# EAGLE design 640 motherboard (EAGLE 6.3)
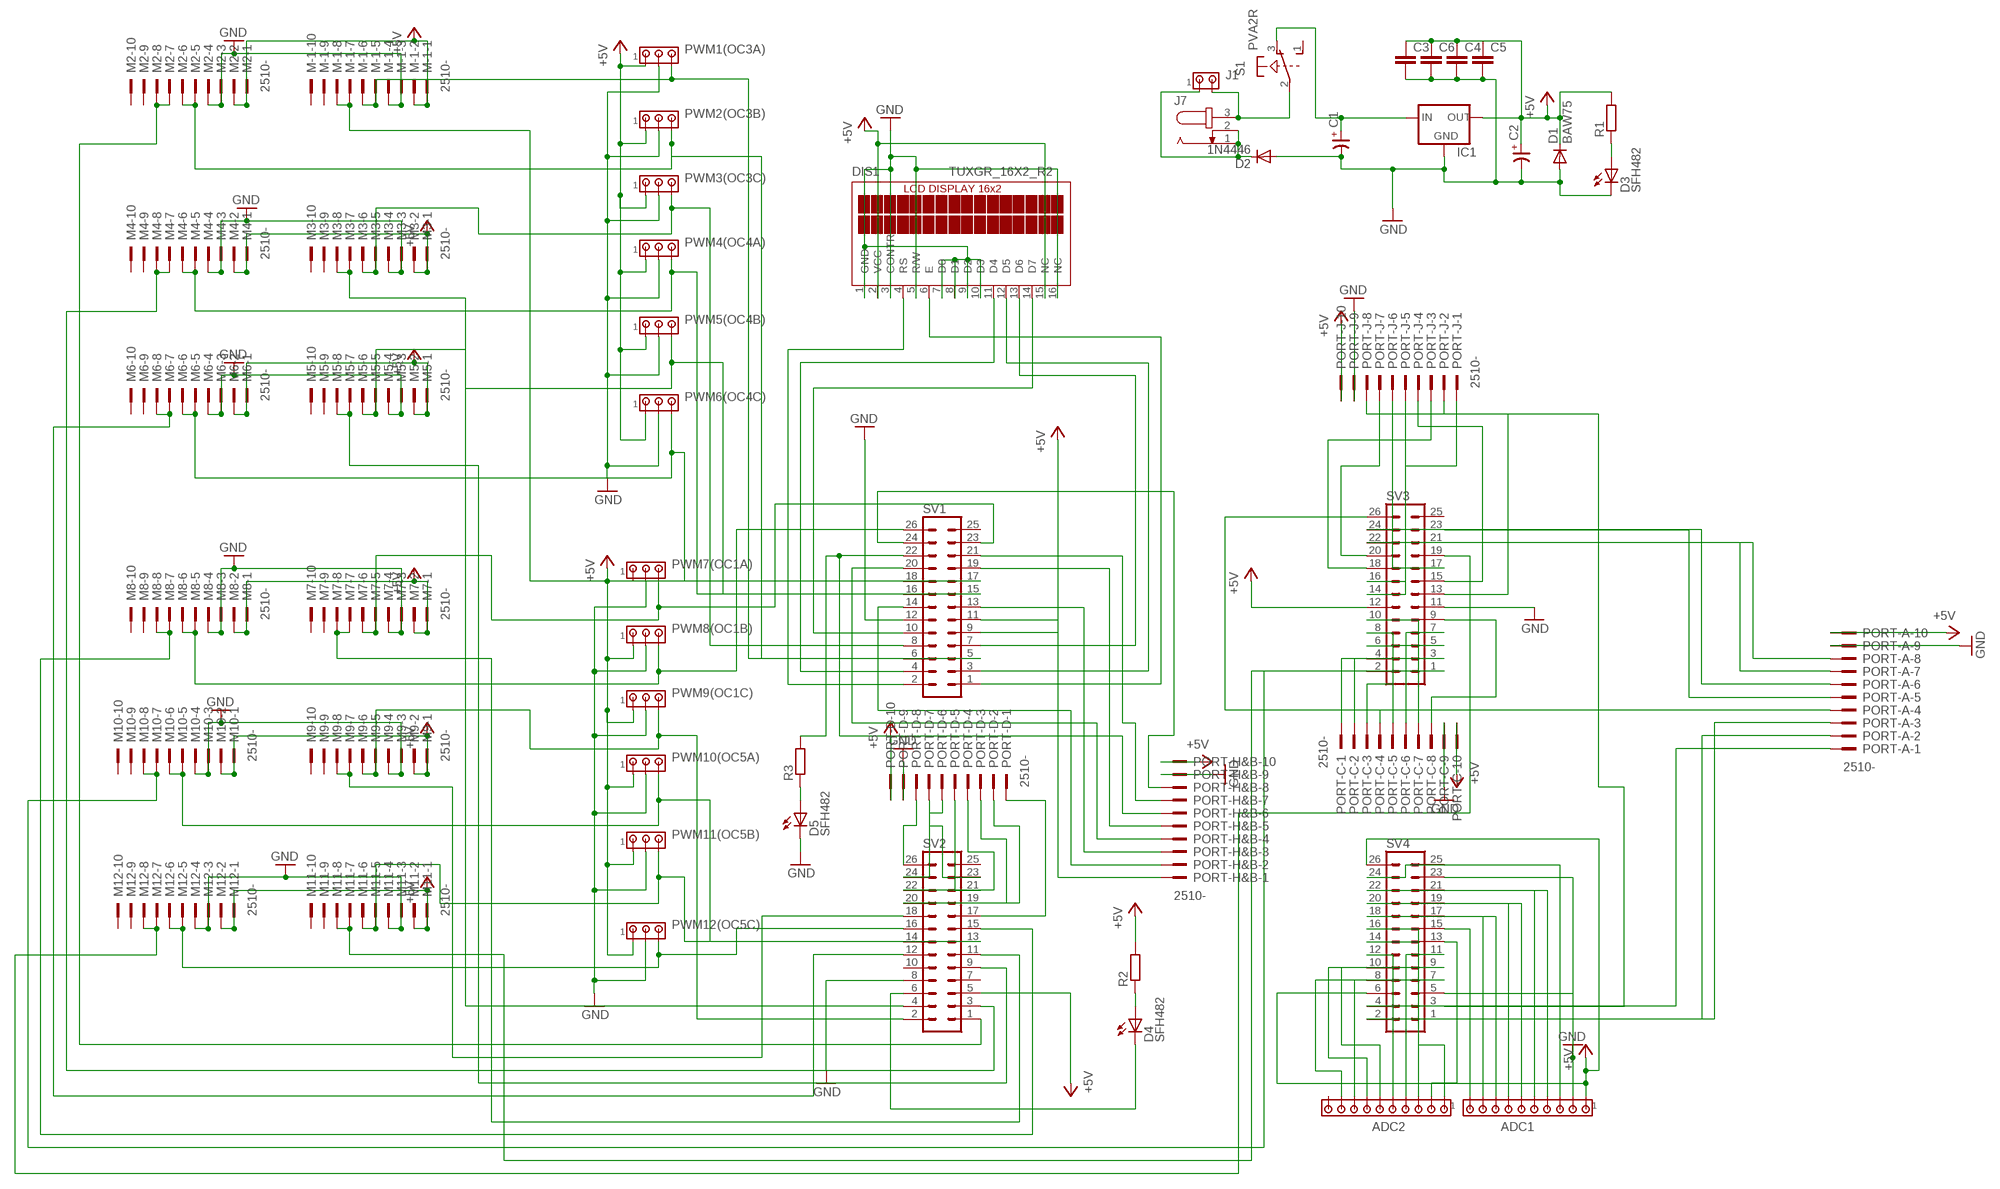
[diagram p0: schematic, sheet 1]

## Parts
ADC1  MTA10-100  [10X10MTA]
ADC2  MTA10-100  [10X10MTA]
C1  CP-E-050X125  [E-050X125]
C2  CP-E-050X125  [E-050X125]
C3  C2.5/2  [C2.5-2]
C4  C2.5/2  [C2.5-2]
C5  C2.5/2  [C2.5-2]
C6  C2.5/2  [C2.5-2]
D1  BAW75  [DO35-10]
D2  1N4446  [DO35-10]
D3  SFH482  [SFH482]
D4  SFH482  [SFH482]
D5  SFH482  [SFH482]
DIS1  TUXGR_16X2_R2  [TUXGR_16X2_R2]
IC1  LM323-TO3  [TO3-K02]
J1  MTA02-156  [1X2MTA]
J7  JACK-PLUG1  [SPC4078]
M2  2510-  [PAK100/2500-10]
M3  2510-  [PAK100/2500-10]
M4  2510-  [PAK100/2500-10]
M5  2510-  [PAK100/2500-10]
M6  2510-  [PAK100/2500-10]
M7  2510-  [PAK100/2500-10]
M8  2510-  [PAK100/2500-10]
M9  2510-  [PAK100/2500-10]
M10  2510-  [PAK100/2500-10]
M11  2510-  [PAK100/2500-10]
M12  2510-  [PAK100/2500-10]
M-1  2510-  [PAK100/2500-10]
PORT-A  2510-  [PAK100/2500-10]
PORT-C  2510-  [PAK100/2500-10]
PORT-D  2510-  [PAK100/2500-10]
PORT-H&B  2510-  [PAK100/2500-10]
PORT-J  2510-  [PAK100/2500-10]
PWM1(OC3A)  MTA03-100  [10X03MTA]
PWM2(OC3B)  MTA03-100  [10X03MTA]
PWM3(OC3C)  MTA03-100  [10X03MTA]
PWM4(OC4A)  MTA03-100  [10X03MTA]
PWM5(OC4B)  MTA03-100  [10X03MTA]
PWM6(OC4C)  MTA03-100  [10X03MTA]
PWM7(OC1A)  MTA03-100  [10X03MTA]
PWM8(OC1B)  MTA03-100  [10X03MTA]
PWM9(OC1C)  MTA03-100  [10X03MTA]
PWM10(OC5A)  MTA03-100  [10X03MTA]
PWM11(OC5B)  MTA03-100  [10X03MTA]
PWM12(OC5C)  MTA03-100  [10X03MTA]
R1  R-EU_0207/10  [0207/10]
R2  R-EU_0207/10  [0207/10]
R3  R-EU_0207/10  [0207/10]
S1  PVA2R  [PVA2R]
SV1  ML26  [ML26]
SV2  ML26  [ML26]
SV3  ML26  [ML26]
SV4  ML26  [ML26]

## Nets
+5V: ADC1.1 C2.+ C3.1 C4.1 C5.1 C6.1 D1.C DIS1.2(VCC) DIS1.15(NC) IC1.1(OUT) M2.1 M2.2 M3.1 M3.2 M4.1 M4.2 M5.1 M5.2 M6.1 M6.2 M7.1 M7.2 M8.1 M8.2 M9.1 M9.2 M10.1 M10.2 M11.1 M11.2 M12.1 M12.2 M-1.1 M-1.2 PORT-A.10 PORT-C.10 PORT-D.10 PORT-H&B.10 PORT-J.10 PWM1(OC3A).1 PWM2(OC3B).1 PWM3(OC3C).1 PWM4(OC4A).1 PWM5(OC4B).1 PWM6(OC4C).1 PWM7(OC1A).1 PWM8(OC1B).1 PWM9(OC1C).1 PWM10(OC5A).1 PWM11(OC5B).1 PWM12(OC5C).1 R1.2 R2.2 SV1.9 SV2.5 SV3.12 SV4.6 SV4.26
GND: ADC1.2 C1.- C2.- C3.2 C4.2 C5.2 C6.2 D1.A D2.A D3.K(C) D5.K(C) DIS1.1(GND) DIS1.3(CONTR) DIS1.5(R/W) DIS1.7(D0) DIS1.8(D1) DIS1.9(D2) DIS1.10(D3) DIS1.16(NC) IC1.3(GND) M2.3 M2.4 M3.3 M3.4 M4.3 M4.4 M5.3 M5.4 M6.3 M6.4 M7.3 M7.4 M8.3 M8.4 M9.3 M9.4 M10.3 M10.4 M11.3 M11.4 M12.3 M12.4 M-1.3 M-1.4 PORT-A.9 PORT-C.9 PORT-D.9 PORT-H&B.9 PORT-J.9 PWM1(OC3A).2 PWM2(OC3B).2 PWM3(OC3C).2 PWM4(OC4A).2 PWM5(OC4B).2 PWM6(OC4C).2 PWM7(OC1A).2 PWM8(OC1B).2 PWM9(OC1C).2 PWM10(OC5A).2 PWM11(OC5B).2 PWM12(OC5C).2 SV1.12 SV2.8 SV3.11 SV4.5 SV4.23
N$1: C1.+ IC1.2(IN) S1.3(1:O)
N$2: D2.C J1.1 J7.1 J7.2
N$3: PORT-C.1 SV3.4
N$4: M2.5 M2.6 PWM2(OC3B).3 SV1.5
N$5: M3.5 M3.6 PWM3(OC3C).3 SV1.8
N$6: M4.5 M4.6 PWM4(OC4A).3 SV1.16
N$7: M5.5 M5.6 PWM5(OC4B).3 SV1.15
N$8: M6.5 M6.6 PWM6(OC4C).3 SV1.18
N$9: M12.5 M12.6 PWM12(OC5C).3 SV2.16
N$10: PORT-C.2 SV3.3
N$11: M10.5 M10.6 PWM10(OC5A).3 SV2.14
N$12: M9.5 M9.6 PWM9(OC1C).3 SV2.2
N$13: M8.5 M8.6 PWM8(OC1B).3 SV1.26
N$14: M7.5 M7.6 PWM7(OC1A).3 SV1.23
N$15: ADC1.4 SV4.21
N$16: ADC1.5 SV4.22
N$17: ADC1.3 SV4.24
N$18: ADC1.6 SV4.19
N$19: ADC1.7 SV4.20
N$20: ADC1.8 SV4.17
N$21: ADC1.9 SV4.18
N$22: ADC1.10 SV4.15
N$23: ADC2.1 SV4.16
N$24: ADC2.2 SV4.13
N$25: ADC2.3 SV4.14
N$26: ADC2.4 SV4.11
N$27: ADC2.5 SV4.12
N$28: ADC2.7 SV4.10
N$29: ADC2.6 SV4.9
N$30: ADC2.9 SV4.8
N$31: M-1.5 M-1.6 PWM1(OC3A).3 SV1.6
N$32: M11.5 M11.6 PWM11(OC5B).3 SV2.13
N$33: PORT-C.3 SV3.6
N$34: PORT-C.4 SV3.5
N$35: PORT-C.5 SV3.8
N$36: PORT-C.6 SV3.7
N$37: PORT-C.7 SV3.10
N$38: PORT-C.8 SV3.9
N$39: PORT-J.1 SV3.14
N$40: PORT-J.2 SV3.13
N$41: PORT-J.3 SV3.16
N$42: PORT-J.4 SV3.15
N$43: PORT-J.5 SV3.18
N$44: PORT-J.6 SV3.17
N$45: PORT-J.7 SV3.20
N$46: PORT-J.8 SV4.3
N$47: ADC2.8 SV4.7
N$48: PORT-A.1 SV4.4
N$49: PORT-A.2 SV4.1
N$50: PORT-A.3 SV4.2
N$51: PORT-A.4 SV3.26
N$52: PORT-A.5 SV3.23
N$53: PORT-A.6 SV3.24
N$54: PORT-A.7 SV3.21
N$55: PORT-A.8 SV3.22
N$56: PORT-D.8 SV2.26
N$57: PORT-D.7 SV2.23
N$58: PORT-D.6 SV2.24
N$59: PORT-D.5 SV2.21
N$60: PORT-D.2 SV2.20
N$61: PORT-D.3 SV2.19
N$62: PORT-D.4 SV2.22
N$63: PORT-D.1 SV2.17
N$64: D3.A R1.1
N$65: J1.2 J7.3 S1.2(1:P)
N$66: DIS1.11(D4) SV1.4
N$67: DIS1.12(D5) SV1.3
N$68: DIS1.13(D6) SV1.7
N$69: DIS1.14(D7) SV1.10
N$70: DIS1.4(RS) SV1.2
N$71: DIS1.6(E) SV1.1
N$72: PORT-H&B.1 SV1.11
N$73: M2.7 M2.8 SV2.1
N$74: PORT-H&B.2 SV1.14
N$75: PORT-H&B.3 SV1.13
N$76: PORT-H&B.4 SV1.20
N$77: M3.7 M3.8 SV2.4
N$78: PORT-H&B.5 SV1.19
N$79: M-1.7 M-1.8 SV1.17
N$80: M5.7 M5.8 SV2.9
N$81: M4.7 M4.8 SV2.3
N$82: PORT-H&B.6 R3.2 SV1.22
N$83: PORT-H&B.7 SV1.21
N$84: M7.7 M7.8 SV2.11
N$85: M6.7 M6.8 SV2.12
N$86: PORT-H&B.8 SV1.24
N$87: D4.A R2.1
N$88: M9.7 M9.8 SV2.18
N$89: M8.7 M8.8 SV2.15
N$90: M11.7 M11.8 SV3.1
N$91: D4.K(C) SV2.6
N$92: M10.7 M10.8 SV3.2
N$97: M12.7 M12.8 SV3.19
N$104: D5.A R3.1
Unconnected: ADC2.10 M2.9 M2.10 M3.9 M3.10 M4.9 M4.10 M5.9 M5.10 M6.9 M6.10 M7.9 M7.10 M8.9 M8.10 M9.9 M9.10 M10.9 M10.10 M11.9 M11.10 M12.9 M12.10 M-1.9 M-1.10 S1.1(1:S) S1.4(2:S) S1.5(2:P) S1.6(2:O) SV1.25 SV2.7 SV2.10 SV2.25 SV3.25 SV4.25

## Library data of the parts
ADC1 ADC2 = con-amp:MTA10-100: AMP connector
C1 C2 = cap-master:CP-: POLARIZED CAP
C3-C6 = capacitor-wima:C: CAPACITOR naming: grid - package width
D1 = diode:BAW75: DIODE silicon-epitaxial planar diode
D2 = diode:1N4446: DIODE high speed (Philips)
D3-D5 = led:SFH482: IR LED infrared emitting diode, Infineon
DIS1 = display-lcd:TUXGR_16X2_R2: Tuxgraphics LCD display 16x2 characters reflective, without background light Source: tuxgr_12x2_r2.pdf
IC1 = v-reg:LM323-TO3: VOLTAGE REGULATOR
J1 = con-amp:MTA02-156: AMP connector
J7 = con-jack:JACK-PLUG: DC POWER JACK Power Jack, DC, Right Angle, Through Hole, Rated 5A at 16VDC, PC Terminals Distributor: Farnell (www.Farnell.de) Drawing: 84N1161.pdf / 84N1162.pdf Manufacturer: SPC Technology (www.spctechnology.com) Type: SPC4077 / SPC 4078
M2-M12 M-1 PORT-A PORT-C PORT-D PORT-H&B PORT-J = con-3m:2510-: 3M (TM) Pak 100 4-Wall Header Source: 3M
PWM1(OC3A) PWM2(OC3B) PWM3(OC3C) PWM4(OC4A) PWM5(OC4B) PWM6(OC4C) PWM7(OC1A) PWM8(OC1B) PWM9(OC1C) PWM10(OC5A) PWM11(OC5B) PWM12(OC5C) = con-amp:MTA03-100: AMP connector
R1-R3 = resistor:R-EU_: RESISTOR, European symbol
S1 = switch-misc:PVA2R: ITT SWITCH
SV1-SV4 = con-harting-ml:ML26: HARTING

## Board
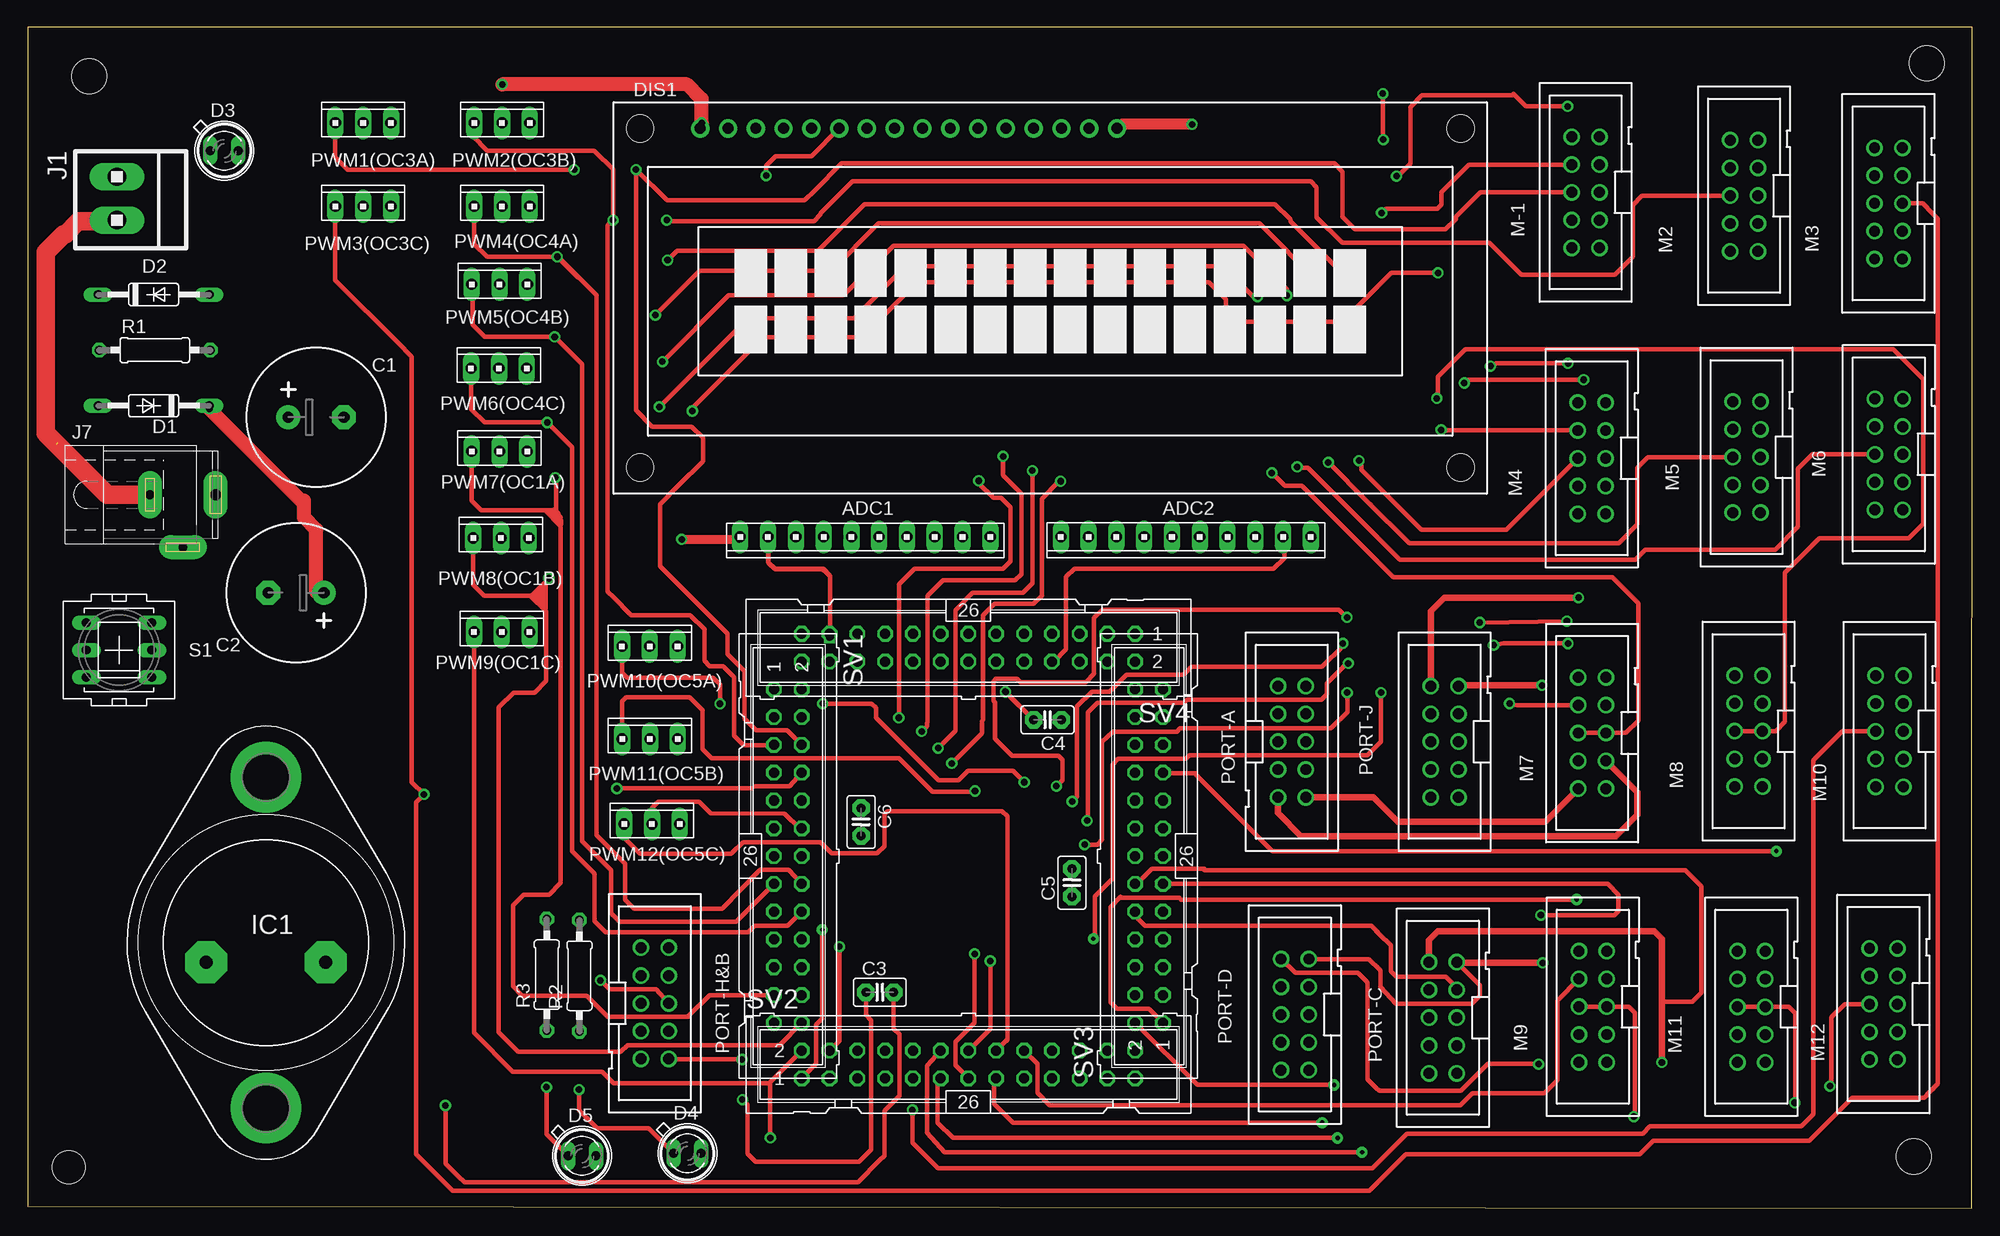
[diagram p1: board, top side]
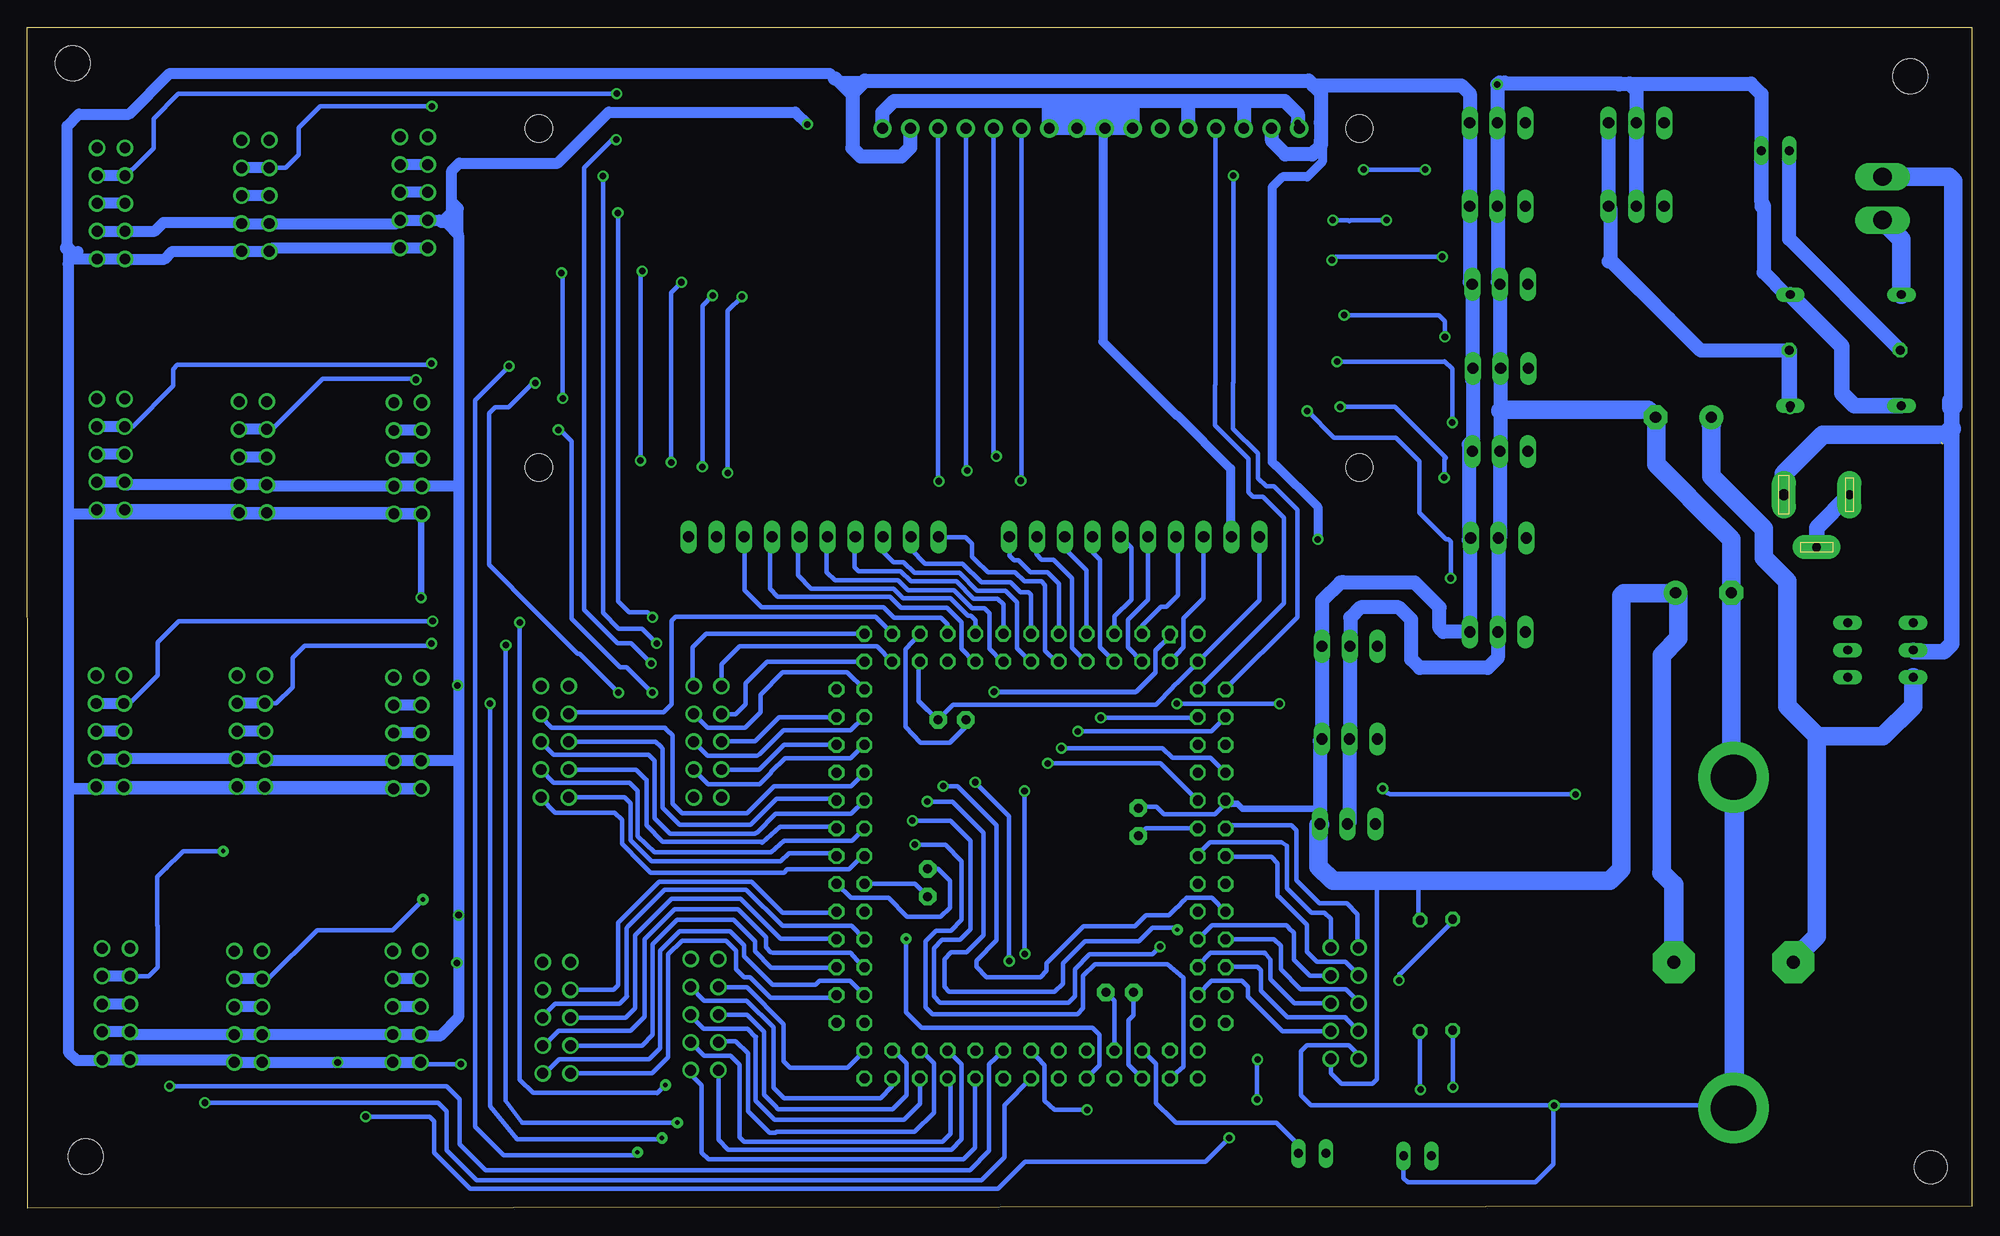
[diagram p2: board, bottom side, seen from below]

Size 177.78 x 107.93 mm. Coordinates in mm from the lower left corner, seen from the top.
Outline: 0,0.19 177.76,0 177.78,107.93 0.03,107.92 0,0.19
Copper layers (1*16): Top 0.035mm / dielectric 1.5mm / Bottom 0.035mm
Design rules "default": minimum track width 10mil, minimum drill 24mil, track to track 8mil, track to pad 8mil, pad to pad 8mil, via to via 8mil, smd to smd 8mil, copper to edge 40mil, drill to drill 8mil, minimum pad ring 10mil, minimum via ring 8mil, stop-mask expansion 4mil, vias tented up to drill 0mil, thermal gap 10mil
Holes 3.2 mm at 5.63,103.46 172.46,4.72 173.62,104.63
Holes 3 mm at 3.76,3.73

### Footprints (pad centres in the part's own frame; a part is rotated, then mirrored left to right if it is on the bottom)
10X10MTA = drill 1.016 long: 1 11.43,0; 2 8.89,0; 3 6.35,0; 4 3.81,0; 5 1.27,0; 6 -1.27,0; 7 -3.81,0; 8 -6.35,0; 9 -8.89,0; 10 -11.43,0
E-050X125 = drill 1.016 pad 2.184: + -2.54,0 | drill 1.016 pad 2.184 octagon: - 2.54,0
C2.5-2 = drill 0.813 pad 1.6 octagon: 1 -1.27,0; 2 1.27,0
DO35-10 = drill 0.813 long: A 5.08,0; C -5.08,0
SFH482 = drill 0.813 long: A -1.27,0; K 1.27,0
TUXGR_16X2_R2 = drill 1 pad 1.676: 1 -32,15.5; 2 -29.46,15.5; 3 -26.92,15.5; 4 -24.38,15.5; 5 -21.84,15.5; 6 -19.3,15.5; 7 -16.76,15.5; 8 -14.22,15.5; 9 -11.68,15.5; 10 -9.14,15.5; 11 -6.6,15.5; 12 -4.06,15.5; 13 -1.52,15.5; 14 1.02,15.5; 15 3.56,15.5; 16 6.1,15.5 | hole 2.5: -37.5,-15.5; 37.5,-15.5; -37.5,15.5; 37.5,15.5
TO3-K02 = drill 1.194 pad 3.81 octagon: 1 -1.778,-5.461; 2 -1.778,5.461 | drill 4.115 pad 6.477: 3 15.113,0; 3@ -15.113,0
1X2MTA = drill 1.676 long: 1 1.981,0; 2 -1.981,0
SPC4078 = drill 0.8 pad 2.184 long: 1 -3,0; 2 0,-4.8 | drill 1 pad 2.184 long: 3 3,0
PAK100/2500-10 = drill 1 pad 1.422: 1 -5.08,-1.27; 2 -5.08,1.27; 3 -2.54,-1.27; 4 -2.54,1.27; 5 0,-1.27; 6 0,1.27; 7 2.54,-1.27; 8 2.54,1.27; 9 5.08,-1.27; 10 5.08,1.27
10X03MTA = drill 1.016 long: 1 2.54,0; 2 0,0; 3 -2.54,0
0207/10 = drill 0.813 octagon: 1 -5.08,0; 2 5.08,0
PVA2R = drill 0.813 long: 1 -2.997,2.489; 2 -2.997,0; 3 -2.997,-2.489; 4 2.997,2.489; 5 2.997,0; 6 2.997,-2.489
ML26 = drill 0.914 octagon: 1 -15.24,-1.27; 2 -15.24,1.27; 3 -12.7,-1.27; 4 -12.7,1.27; 5 -10.16,-1.27; 6 -10.16,1.27; 7 -7.62,-1.27; 8 -7.62,1.27; 9 -5.08,-1.27; 10 -5.08,1.27; 11 -2.54,-1.27; 12 -2.54,1.27; 13 0,-1.27; 14 0,1.27; 15 2.54,-1.27; 16 2.54,1.27; 17 5.08,-1.27; 18 5.08,1.27; 19 7.62,-1.27; 20 7.62,1.27; 21 10.16,-1.27; 22 10.16,1.27; 23 12.7,-1.27; 24 12.7,1.27; 25 15.24,-1.27; 26 15.24,1.27

### Placement (x,y rotation side)
ADC1  76.58,61.35 180 top
ADC2  105.89,61.36 180 top
C1  26.38,72.3 0 top
C2  24.55,56.25 180 top
C3  77.91,19.73 0 top
C4  93.25,44.63 180 top
C5  95.48,29.75 90 top
C6  76.21,35.3 270 top
D1  11.52,73.35 180 top
D2  11.52,83.51 0 top
D3  17.98,96.65 0 top
D4  60.32,5.01 0 top
D5  50.68,4.79 0 top
DIS1  93.5,83.19 0 top
IC1  21.79,24.26 90 top
J1  8.17,92.29 270 top
J7  14.2,65.21 0 top
M2  156.93,92.54 90 top
M3  170.12,91.84 90 top
M4  143,68.54 90 top
M5  157.15,68.65 90 top
M6  170.16,68.9 90 top
M7  143.04,43.43 90 top
M8  157.34,43.6 90 top
M9  143.1,18.41 90 top
M10  170.23,43.59 90 top
M11  157.59,18.41 90 top
M12  169.67,18.66 90 top
M-1  142.44,92.84 90 top
PORT-A  115.58,42.63 270 top
PORT-C  129.4,17.41 90 top
PORT-D  115.86,17.69 90 top
PORT-H&B  57.34,18.72 270 top
PORT-J  129.55,42.63 90 top
PWM1(OC3A)  30.68,99.19 0 top
PWM2(OC3B)  43.38,99.19 0 top
PWM3(OC3C)  30.68,91.57 0 top
PWM4(OC4A)  43.38,91.57 0 top
PWM5(OC4B)  43.15,84.44 0 top
PWM6(OC4C)  43.09,76.76 0 top
PWM7(OC1A)  43.14,69.17 0 top
PWM8(OC1B)  43.28,61.25 0 top
PWM9(OC1C)  43.35,52.66 0 top
PWM10(OC5A)  56.88,51.36 0 top
PWM11(OC5B)  56.9,42.88 0 top
PWM12(OC5C)  57.08,35.11 0 top
R1  11.63,78.43 0 top
R2  50.45,21.24 90 top
R3  47.47,21.34 90 top
S1  8.36,51.01 0 top
SV1  69.51,32.18 270 top
SV2  86.02,13.13 0 top
SV3  102.53,32.18 90 top
SV4  86.02,51.23 180 top

### Tracks (layer width: path | path; a pad name or v marks a point on that pad's centre or on a via)
+5V  (via drill 0.6 pad 1.02)
  Top 0.406: C3.1 76.64,17.66 77.06,17.24 77.06,17.22 77.13,17.15 77.13,5.36 76.02,4.26 66.56,4.26 65.83,4.98 65.83,9.44 v65.35,9.92 | v65.31,13.59 58.66,13.59 PORT-H&B.10 | SV3.12 101.42,29.64 102.81,31.03 107.44,31.03 | 107.44,31.03 107.58,31.03 | 149.41,19.1 149.63,18.88 152.2,18.88 153.01,19.69 153.01,29.43 151.55,30.89 107.58,30.89 107.44,31.03 | PORT-D.10 114.62,22.77 115.9,21.5 121.65,21.5 122.48,20.66 122.48,11.8 123.32,10.97 | 123.32,10.97 | 123.32,10.97 123.57,10.72 131.03,10.72 132.24,11.93 133.51,13.2 138.11,13.2 v138.14,13.17
  Top 0.61: PORT-J.10 128.28,54.54 129.54,55.8 v141.79,55.8 | PORT-C.10 128.13,24.51 128.95,25.33 148.71,25.33 149.41,24.63 149.41,19.1 v149.41,13.33 | PORT-A.10 123.06,37.55 125.27,35.34 138.75,35.34 M7.2
  Top 0.813: v65.06,61.12 59.82,61.12 v59.81,61.13
  Top 1.27: C2.+ 26.39,56.32 26.39,62.02 25.28,63.13 25.28,64.67 25.01,64.67 v16.63,73.06 16.6,73.08 D1.C
  Bottom 0.406: PORT-H&B.10 58.62,12.33 57.66,11.38 54.83,11.38 54.41,11.79 54.41,29.15 54.34,29.22 54.34,29.71 54.55,29.92 | 51.66,29.92 51.47,29.73 | 48.61,29.92 48.97,29.56 | 94.55,44.63 C4.1 93.13,46.02 74.61,46.02 73.03,47.6 73.03,47.65 72.42,48.26 70.78,49.9 SV4.26 65.15,55.59 | 94.55,44.63 96.28,46.37 96.28,49.86 SV4.6 | SV1.9 68.24,36.97 69.22,35.98 73.86,35.98 74.55,36.68 76.1,36.68 C6.1 | C3.1 76.64,17.65 77.11,17.18 77.11,13.12 SV2.5 | SV3.12 96.64,29.64 C5.1 | 65.15,55.59 ADC1.1 | PWM1(OC3A).1 33.22,86.54 32.9,86.22 32.72,86.22 30.48,83.98 | v16.63,73.06 16.25,73.43 | 94.55,44.63 94.59,44.63 96.3,46.34 | v65.35,9.92 65.35,13.55 v65.31,13.59 | 142.22,63.46 141.79,63.03 | v138.14,13.17 141.67,13.17 M9.2 | 65.15,55.59 65.15,61.03 v65.06,61.12 | R2.2 50.59,26.32 50.59,29.92
  Bottom 0.61: 68.24,36.97 67.14,36.97 66.68,36.5 59.88,36.5 59.62,36.24 | 141.79,63.03 v141.79,55.8
  Bottom 0.813: 63.99,73.51 63.99,93.3 63.03,94.27 60.77,94.27 59.38,95.66 59.38,97.41 59.52,97.55 | 63.99,73.51 63.99,72.99 | v59.81,61.13 59.81,64.1 63.61,67.9 63.67,67.9 63.99,68.22 63.99,73.51
  Bottom 1: 102.36,101.91 102.61,101.91 103.76,103.05
  Bottom 1.016: M-1.2 M-1.1 155.36,87.76 M2.2 M2.1 164.52,87.46 165.23,86.75 M3.2 M3.1 173.73,86.76 173.8,86.82 | M6.1 M6.2 158.68,63.82 M5.1 M5.2 144.37,63.57 M4.1 142.22,63.46 | M10.1 M10.2 158.62,38.51 M8.1 M8.2 144.47,38.52 M7.1 M7.2 | M9.2 M9.1 v149.41,13.33 M11.2 M11.1 159.11,13.58 M12.2 M12.1 171.02,13.5 173.25,13.5 174.03,14.27 174.03,38.69 | 173.8,86.82 173.51,87.11 173.16,87.46 | 173.8,86.82 174.03,86.59 174.03,63.51 | 174.03,63.51 174.03,38.69 | M7.2 173.69,38.35 174.03,38.69 | 142.22,63.46 173.98,63.46 174.03,63.51 | 142.22,63.46 M4.2 | M7.2 173.79,38.35 173.97,38.53 | 103.93,103.23 103.76,103.05 | 103.94,103.23 104.43,103.71 164.75,103.71 168.47,100 173.07,100 174.16,98.91 174.16,87.76
  Bottom 1.27: PWM1(OC3A).1 PWM3(OC3C).1 33.06,91.41 33.06,86.6 30.42,83.95 | 46.01,69.78 46.01,61.05 45.83,61.24 PWM8(OC1B).1 45.89,61.19 PWM9(OC1C).1 48.32,52.66 48.67,53.02 48.67,54.92 50.94,57.18 57.48,57.18 | 46.01,69.78 45.81,69.98 45.81,69.3 PWM7(OC1A).1 | 45.63,75.64 45.63,70.16 46.01,69.78 | 45.63,75.64 PWM6(OC4C).1 | 45.63,75.64 45.69,75.7 PWM5(OC4B).1 45.92,84.67 PWM4(OC4A).1 PWM2(OC3B).1 45.92,101.86 46.69,102.63 60.2,102.63 60.38,102.8 | 59.42,50.8 59.42,42.9 PWM11(OC5B).1 59.62,42.7 59.62,36.24 PWM12(OC5C).1 | 59.42,50.8 PWM10(OC5A).1 | 57.48,57.18 57.76,57.18 59.41,55.52 59.41,50.81 59.42,50.8 | DIS1.15 97.06,96.95 97.88,96.13 101.59,96.13 102.36,96.89 102.36,101.91 101.21,103.05 60.63,103.05 60.38,102.8 | 60.38,102.8 59.52,101.94 59.52,99.23 | 59.52,99.23 59.52,97.55 59.52,97.12 60.32,96.32 62.77,96.32 63.99,97.54 63.99,98.65 DIS1.2 | 59.52,99.23 59.49,99.19 | 57.48,57.18 57.52,57.22 | 103.94,103.23 103.93,103.23 | 173.51,87.11 174.16,87.76 | 28.99,82.61 32.92,86.54 33.22,86.54 32.92,86.54 27.69,81.31 24.77,78.38 16.76,78.38 R1.2
  Bottom 1.422: R1.2 16.71,73.46 D1.C
  Bottom 1.676: PWM12(OC5C).1 59.74,35 59.74,31.22 58.44,29.92 54.55,29.92 51.66,29.92 50.59,29.92 48.61,29.92 33.11,29.92 32.04,30.99 32.04,55.97 31.81,56.2 27.15,56.2 C2.+ 26.82,55.98 26.82,52.08 28.36,50.54 28.36,30.67
  Bottom 1.778: IC1.1 27.25,29.56 28.36,30.67
GND  (via drill 0.6, 0.6 pad 1.02)
  Top 0.406: v73.32,52.15 SV4.23 73.38,52.57 73.38,57.81 72.77,58.42 68.32,58.42 67.72,59.02 67.72,61.33 ADC1.2 | C4.2 89.71,46.9 89.7,46.9 v89.39,47.21 | SV1.12 70.57,34.72 69.18,36.05 62.45,36.09 61.41,37.15 57.66,37.15 57.09,36.58 PWM12(OC5C).2 | C3.2 79.18,16.41 79.72,15.88 79.72,10.29 78.34,8.91 78.34,4.8 77.9,4.36 | 77.9,4.36 | 130.9,47.79 PORT-J.9 | 130.73,22.43 PORT-C.9 132.77,20.38 132.77,19.43 132.05,18.7 125.11,18.7 123.69,20.22 123.69,21.73 122.65,22.77 PORT-D.9 | v138.35,26.78 145.06,26.78 145.44,27.16 145.44,28.66 144.46,29.64 SV3.11 | v92.05,44.58 92.01,44.58 v89.41,47.18 | v73.41,52.19 73.41,52.22 73.38,52.25 73.38,57.74 72.8,58.32 72.74,58.32 72.68,58.38 68.32,58.38 67.74,58.96 67.74,61.36 v67.77,61.39 | v38.2,9.38 38.2,4.08 39.63,2.65 39.67,2.65 39.94,2.38 75.92,2.38 77.9,4.36
  Top 0.61: v138.46,47.79 130.9,47.79 | v138.51,22.43 130.73,22.43 | PORT-A.9 114.31,36.14 116.43,33.99 134.64,33.99 134.69,33.97 145.2,33.97 147.17,35.94 147.17,38.03 M7.3
  Top 1.016: v106.46,99.06 99.97,99.06 DIS1.16
  Top 1.27: v61.62,99.19 61.62,101.36 60.27,102.71 v43.4,102.71
  Bottom 0.406: PORT-H&B.9 56.08,14.04 56.94,14.91 60.78,14.91 61.33,14.36 61.33,10.31 60.44,9.42 40.04,9.42 | 40.04,9.42 22.17,9.42 22.1,9.49 22.1,39.06 IC1.3 | C4.2 91.98,44.04 93.47,42.54 96.12,42.54 | 96.12,42.54 97.5,44 97.5,51.1 SV4.5 | SV1.12 75.52,34.72 C6.2 | SV2.8 78.4,18.95 C3.2 | C5.2 94.53,31.02 93.43,29.92 93.43,27.47 94.29,26.62 97.34,26.62 99.05,28.37 102.49,28.37 SV3.11 | v73.32,52.15 73.47,52.15 74.64,50.98 74.64,48.95 76.38,47.21 v89.39,47.21 | 40.04,9.42 38.24,9.42 v38.2,9.38 38.26,9.32 38.26,4.02 39.9,2.38 51.59,2.38 51.95,2.75 D5.K | 138.38,40.89 138.38,47.72 v138.46,47.79 | 138.35,17.44 138.35,22.27 v138.51,22.43 | 96.12,42.54 93.42,42.54 91.92,44.04 91.92,44.45 v92.05,44.58 | v89.41,47.18 76.46,47.18 74.64,48.99 74.64,50.98 74.62,50.98 v73.41,52.19
  Bottom 0.813: v67.77,61.39 67.77,67.61 72.63,72.47 72.71,72.47 79.45,79.21 79.45,98.51 DIS1.8
  Bottom 1.016: M3.3 M3.4 166.13,89.29 165.32,90.1 158.3,90.1 M2.3 M2.4 144.02,90 M-1.3 M-1.4 140.12,90.3 139.91,90.1 | M6.3 M6.4 168.63,66.11 M5.3 M5.4 155.78,66 M4.3 M4.4 139.29,66 139.28,65.99 138.35,65.99 | M10.3 M10.4 168.94,41.06 M8.3 M8.4 155.9,40.89 M7.3 M7.4 138.38,40.89 138.35,40.86 | M12.3 M12.4 168.15,15.87 M11.3 M11.4 M9.3 M9.4 141.69,15.73 140.06,15.73 138.35,17.44 v138.35,26.78 138.35,40.86 | 139.91,90.1 139.51,90.1 138.35,88.94 138.35,65.99 | 138.35,65.99 138.35,40.86 | v106.46,99.06 107.58,100.18 124.62,100.18 129.29,95.51 138.3,95.51 138.98,94.83 138.98,91.03 139.91,90.1
  Bottom 1.27: PWM1(OC3A).2 PWM3(OC3C).2 30.68,102.15 31.3,102.78 32.18,102.78 | 43.35,90.94 43.38,90.98 PWM4(OC4A).2 43.35,91.54 43.35,90.94 | 43.35,90.9 43.35,90.94 | 19.25,91.93 D3.K | 19.25,91.93 19.25,101.82 19.76,102.34 20.2,102.78 32.18,102.78 | 19.25,91.93 19.25,91.57 | 43.38,102.7 PWM2(OC3B).2 43.38,90.94 43.35,90.9 | 43.38,102.7 43.18,102.89 43.1,102.81 42.63,102.81 | 32.18,102.78 32.24,102.71 32.24,102.74 32.32,102.81 42.63,102.81 | v43.4,102.71 43.38,102.7 | 42.63,102.81 42.7,102.89 | 43.35,90.9 43.35,84.64 PWM5(OC4B).2 43.15,76.82 PWM6(OC4C).2 43.09,72.9 43.09,69.23 PWM7(OC1A).2 43.14,61.4 PWM8(OC1B).2 43.29,52.73 PWM9(OC1C).2 43.35,50.31 44.28,49.38 50.49,49.38 51.26,50.15 51.26,53.79 52.39,54.92 55.9,54.92 56.83,53.99 56.83,51.41 PWM10(OC5A).2 56.88,42.9 PWM11(OC5B).2 56.9,35.62 56.91,35.61 56.91,35.29 PWM12(OC5C).2 | DIS1.8 DIS1.9 DIS1.10 | DIS1.7 DIS1.8 | DIS1.16 99.6,100.15 98.53,101.22 76.65,101.22 | 66.52,101.22 62.85,101.22 61.62,99.99 v61.62,99.19 | 71.72,101.22 66.52,101.22 | 76.65,101.22 71.72,101.22 | v61.62,99.19 61.62,98.81 DIS1.1 61.5,99.06 v61.62,99.19 | 66.52,101.22 66.58,101.16 DIS1.3 66.61,98.65 | DIS1.7 76.74,101.14 76.65,101.22 | DIS1.7 DIS1.8 | DIS1.8 84.31,98.69 84.38,98.62 84.38,100.61 77.34,100.61 77,100.26 77,99.69 77.08,99.61 83.42,99.61 83.58,99.46 | DIS1.5 71.66,101.15 71.72,101.22 | D2.A 17,83.51 19.03,85.54 19.03,91.71 19.25,91.93
  Bottom 1.422: D1.A 10.75,73.35 11.89,74.48 11.89,78.79 D2.A
  Bottom 1.676: 43.09,72.9 43.01,72.98 29.61,72.98 C1.- 28.84,72.22 28.84,67.97 26.98,66.11 24.68,63.81 22.01,61.14 C2.- 22.01,39.6 IC1.3
  Bottom 1.778: IC1.3 22.97,40.55
N$1
  Bottom 1.676: IC1.2 16.33,22.69 14.16,24.86 14.16,43.17 | 14.16,43.17 16.87,45.88 16.87,57.31 19.02,59.46 19.02,62.09 21.9,64.97 | 21.9,64.97 22.29,65.36 | 23.84,71.6 23.84,66.91 21.9,64.97 | S1.3 5.36,45.89 8.13,43.12 14.11,43.12 14.16,43.17
  Bottom 1.778: 23.84,71.6 C1.+
N$2  (1 unrouted)
  Top 1.676: 2.65,69.84 2.03,70.46 | 2.03,70.46 1.66,70.83 1.66,87.39 3.3,89.03 3.48,89.03 4.64,90.19 8.06,90.19 J1.1 | J7.1 7.28,65.21 2.03,70.46
  Bottom 1.422: J7.2 14.2,62.21 J7.1
  Bottom 1.676: D2.C 6.44,88.58 J1.1
N$3
  Bottom 0.406: PORT-C.1 130.44,12.33 129.15,13.61 120.92,13.61 119.92,14.6 119.92,23.52 118.13,25.32 113.55,25.32 112.24,24.02 112.24,23.03 109.64,20.43 105.74,20.43 105.37,20.8 102.57,20.8 SV3.4
N$4  (via drill 0.6 pad 1.02)
  Top 0.406: 68.11,42.47 SV1.5 68.21,42.31 66.88,42.31 65.46,42.31 64.6,43.16 64.6,48.54 64.42,48.72 64.39,48.72 63.57,49.54 62.36,49.54 61.88,50.02 61.88,52.9 60.57,54.2 55.19,54.2 53.52,55.87 53.52,55.88 53.04,56.36 53.04,89.84 v53.52,90.31 53.52,94.95 51.8,96.67 42.01,96.67 40.71,97.96 40.71,99.06 PWM2(OC3B).3 | M2.6 147.6,92.54 146.74,91.68 146.74,86.95 145.1,85.31 136.57,85.31 133.66,88.22 120.21,88.22 117.85,90.58 117.85,93.31 117.3,93.86 75.43,93.86 72.52,90.95 72.52,90.86 71.88,90.22 58.53,90.22 v58.44,90.31
  Bottom 0.406: v53.52,90.31 56.8,90.31 56.89,90.22 56.98,90.31 v58.44,90.31
  Bottom 1.016: M2.6 M2.5
N$5  (via drill 0.6 pad 1.02)
  Top 0.406: PWM3(OC3C).3 28.14,84.83 33.83,79.14 35.13,77.84 35.13,38.93 v36.24,37.82 35.53,37.11 35.53,4.93 38.87,1.58 122.66,1.58 126.02,4.95 147.42,4.95 148.64,6.17 162.91,6.17 166.81,10.08 173.38,10.08 173.88,10.57 | v53.87,38.36 66.2,38.36 66.51,38.57 69.65,38.57 SV1.8 | 173.88,10.57 174.27,10.97 | M3.5 173.25,91.84 174.18,90.91 174.65,90.43 174.65,11.35 173.88,10.57
  Bottom 0.406: v36.24,37.82 53.23,37.82 53.35,37.94 53.45,37.94 v53.87,38.36
  Bottom 1.016: M3.6 M3.5
N$6  (via drill 0.6 pad 1.02)
  Top 0.406: PWM4(OC4A).3 40.84,88.12 42,86.96 48.49,86.96 50.38,85.08 | 50.38,85.08 52.03,83.42 52.03,34.09 54.63,31.49 54.63,28.17 55.46,27.35 63.48,27.35 66.98,30.93 69.57,30.93 SV1.16 | v121.72,68.33 121.94,68.54 121.94,67.49 127.42,62 135.21,62 138.44,65.24 138.44,65.26 M4.6 | v121.56,85.64 120.01,85.64 115.44,90.21 115.44,90.37 114.03,91.78 76.52,91.78 72.27,87.53 59.4,87.53 v58.51,86.64 | 50.38,85.08 50.31,85.08 v48.42,86.96
  Bottom 0.406: v121.72,68.33 121.72,85.48 v121.56,85.64 | v48.42,86.96 58.2,86.96 v58.51,86.64
  Bottom 1.016: M4.6 M4.5
N$7  (via drill 0.6 pad 1.02)
  Top 0.406: PWM5(OC4B).3 40.61,85.52 40.68,85.59 40.68,80.73 41.78,79.64 v48.18,79.64 50.22,77.6 50.69,77.13 50.69,33.56 53.34,30.9 53.34,26.98 54.13,26.2 64.79,26.2 SV1.15 | M5.6 148.14,68.65 147.19,67.7 147.19,62.5 145.46,60.77 126.32,60.77 122.5,64.58 | v117.98,84.63 112.61,90 77.81,90 73.48,85.68 61.45,85.68 v57.39,81.62 | v118.92,68.17 122.5,64.58 | 122.5,64.58 122.86,64.23
  Bottom 0.406: v118.92,68.17 118.92,83.69 v117.98,84.63 | v48.18,79.64 48.18,81.05 48.75,81.62 v57.39,81.62
  Bottom 1.016: M5.6 M5.5
N$8  (via drill 0.6 pad 1.02)
  Top 0.406: PWM6(OC4C).3 40.55,73.03 41.77,71.81 v47.52,71.81 49.8,69.53 49.8,32.61 51.86,30.55 51.86,26.2 52.83,25.23 65.87,25.23 66.45,25.81 69.49,25.81 SV1.18 | M6.6 163.19,68.9 161.85,67.56 161.85,62.27 159.78,60.2 147.91,60.2 146.97,59.26 125.47,59.26 117.05,67.67 116.15,67.67 v116.07,67.75 | v115.13,83.42 115.13,84 111.17,87.95 79.15,87.95 74.62,83.42 64.08,83.42 v58.04,77.38
  Bottom 0.406: v116.07,67.75 116.07,82.48 v115.13,83.42 | v58.04,77.38 48.29,77.38 48.24,77.43 47.52,76.7 v47.52,71.81
  Bottom 1.016: M6.6 M6.5
N$9  (via drill 0.6 pad 1.02)
  Top 0.406: PWM12(OC5C).3 54.55,33.84 55.99,32.39 64.32,32.39 65.39,33.46 72.48,33.46 73.49,32.46 77.64,32.46 78.34,33.1 78.34,33.57 78.34,33.63 78.34,36.01 78.61,36.28 89.11,36.28 89.57,35.82 89.57,15.42 89.24,15.09 | 89.24,15.09 SV2.16 | 89.24,15.09 89.5,15.35 | M12.6 166.13,18.66 164.9,17.43 164.9,11.28 v164.77,11.15
  Bottom 0.406: v164.77,11.15 139.47,11.15 138.26,9.94 138.26,5.86 135.86,3.46 91.6,3.46 89.85,5.26 89.85,13.15 SV2.16
  Bottom 1.016: M12.6 M12.5
N$10
  Bottom 0.406: PORT-C.2 120.65,12.33 119.18,13.8 119.18,23.21 117.94,24.45 113.92,24.45 112.99,23.52 112.99,21.85 112.24,21.11 111.69,21.11 109.83,19.25 104.03,19.25 SV3.3
N$11  (via drill 0.6 pad 1.02)
  Top 0.406: PWM10(OC5A).3 54.34,48.95 54.8,48.49 62.68,48.49 63.3,47.87 63.3,46.29 63.28,46.26 63.28,46.12 v63.3,46.1 | v91.12,38.93 91.08,38.89 | v88.01,22.6 88.01,16.4 SV2.14 | v72.69,46.12 77.15,46.12 77.55,45.72 77.55,44.84 83.29,39.1 85.09,39.1 85.97,39.98 90.07,39.98 v91.12,38.93 | v91.12,38.93 90.95,39.1 | M10.6 165.91,43.59 163.25,40.93 163.25,8.59 162.14,7.47 148.31,7.47 147.66,6.82 126.12,6.82 122.96,3.66 83.22,3.66 80.89,5.99 v80.89,8.99
  Bottom 0.406: v63.3,46.1 72.67,46.1 v72.69,46.12 | v91.12,38.93 88.01,35.82 v88.01,22.6 | v80.89,8.99 83.87,8.99 84.8,9.82 84.8,13.08 SV2.14
  Bottom 1.016: M10.6 M10.5
N$12  (via drill 0.6 pad 1.02)
  Top 0.406: PWM9(OC1C).3 40.81,16.03 44.36,12.48 52.51,12.48 53.58,11.4 67.78,11.4 68.03,11.66 | 68.03,11.66 SV2.2 | M9.6 146.39,18.41 146.94,17.87 146.94,8.45 v146.85,8.37 | v67.9,6.42 67.9,11.52 68.03,11.66
  Bottom 0.406: v146.85,8.37 141.01,8.37 140.6,7.96 140.6,5.07 137.28,1.75 121.34,1.75 121.3,1.79 89.02,1.79 86.58,4.24 70.09,4.24 v67.9,6.42
  Bottom 1.016: M9.6 M9.5
N$13  (via drill 0.6 pad 1.02)
  Top 0.406: PWM8(OC1B).3 40.74,56.98 41.73,55.99 45.95,55.99 | 45.95,55.99 47.39,54.55 47.41,54.52 47.41,48.19 46.35,47.12 44.42,47.12 43.08,45.79 43.08,16.07 44.87,14.29 54.21,14.29 54.83,14.91 68.75,14.91 SV1.26 | M8.6 159.83,43.6 160.66,44.44 160.66,58.08 161.75,59.17 161.75,59.18 163.83,61.25 172,61.25 173.31,62.56 173.31,75.77 170.58,78.5 131.45,78.5 128.94,75.98 128.94,74.13 v128.83,74.02 | v128.94,85.48 124.7,85.48 120.22,81.01 110.63,81.01 109.54,82.1 109.54,83.08 108.01,84.61 81.31,84.61 76.29,79.59 67.26,79.59 60.77,73.1 v60.77,72.86 | 45.95,55.99 45.99,55.99 47.37,54.62 47.37,57.28 v47.66,57.58
  Bottom 0.406: v128.83,74.02 128.83,85.37 v128.94,85.48 | 47.86,61.13 47.69,60.97 | v47.66,57.58 47.66,60.93 47.86,61.13 | 47.86,61.13 48.08,61.13 50.53,63.58 50.53,68.29 51.62,69.38 | 51.62,69.38 | 51.62,69.38 52.65,70.41 58.32,70.41 v60.77,72.86
  Bottom 1.016: M8.6 M8.5
N$14  (via drill 0.6 pad 1.02)
  Top 0.406: PWM7(OC1A).3 40.6,64.66 41.47,63.79 47.3,63.79 | 47.3,63.79 48.75,62.34 48.75,32.22 48.74,32.21 48.74,29.73 47.68,28.67 45.36,28.67 44.38,27.69 44.38,20.27 45.22,19.44 51.09,19.44 53.02,17.51 60.42,17.51 60.45,17.53 60.45,17.58 62.35,19.48 SV1.23 | M7.6 146.12,43.43 147.24,44.55 147.24,55.29 144.88,57.65 124.88,57.65 118.62,63.91 | 118.62,63.91 116.5,66.03 114.93,66.03 v113.75,67.21 | 118.62,63.91 118.99,63.54 | v112.44,83.32 112.05,83.32 109.3,86.07 80.27,86.07 75.55,81.35 65.88,81.35 v57.76,73.23 | 47.3,63.79 47.34,63.79 47.8,63.33 47.85,63.33 48.34,63.82 48.34,66.69 v48.25,66.78
  Bottom 0.406: v113.75,67.21 113.75,82.01 v112.44,83.32 | v57.76,73.23 52.73,73.23 48.24,68.74 | 48.24,68.74 48.11,68.61 48.25,68.47 v48.25,66.78 | 48.24,68.74 48.27,68.72
  Bottom 1.016: M7.6 M7.5
N$15
  Bottom 0.406: SV4.21 75.86,53.24 74.13,54.96 73.65,54.96 72.58,56.03 72.58,61.16 ADC1.4
N$16
  Bottom 0.406: ADC1.5 75.31,55.62 77.15,53.78 77.15,51.26 SV4.22
N$17
  Bottom 0.406: ADC1.3 70.23,55.73 72.1,53.93 72.1,51.25 SV4.24
N$18
  Bottom 0.406: SV4.19 78.4,54.09 76.86,55.63 76.86,60.36 ADC1.6
N$19
  Bottom 0.406: ADC1.7 80.39,59.97 79.7,59.28 79.7,51.26 SV4.20
N$20
  Bottom 0.406: SV4.17 80.94,58.31 82.94,60.31 82.94,61.34 ADC1.8
N$21
  Bottom 0.406: SV4.18 81,49.96 82.28,51.24 82.28,57.58 83.98,59.28 85.05,59.28 85.52,59.76 85.52,61.3 ADC1.9
N$22
  Bottom 0.406: SV4.15 83.48,57.08 84.53,58.14 86.08,58.14 87.18,59.24 87.59,59.24 88,59.65 88,61.34 ADC1.10
N$23
  Bottom 0.406: SV4.16 83.71,49.96 84.74,50.94 84.74,56.92 85.06,57.29 86.63,57.29 87.47,58.12 89.97,58.12 91.08,59.23 | 91.08,59.23 | 91.08,59.23 91.4,59.56 91.4,60.72 92.01,61.32 94.43,61.32 ADC2.1
N$24
  Bottom 0.406: SV4.13 86.02,56.07 86.26,56.31 87,56.31 87.88,57.19 90.57,57.19 92.28,58.91 95.71,58.91 97.01,60.21 ADC2.2
N$25
  Bottom 0.406: SV4.14 86.07,49.96 87.28,51.17 87.28,55.39 88.35,56.45 90.94,56.45 92.56,58.07 96.68,58.07 97.66,59.05 98.58,59.05 99.51,59.97 99.51,61.32 ADC2.3
N$26
  Bottom 0.406: SV4.11 88.56,55.18 89.09,55.71 91.26,55.71 92.84,57.29 97.01,57.29 97.93,58.21 101.79,58.21 102.16,58.59 102.16,61.28 ADC2.4
N$27
  Bottom 0.406: SV4.12 88.67,49.96 89.83,51.12 89.83,54.37 90.29,54.83 91.4,54.83 93.07,56.5 97.29,56.5 98.17,57.38 103.95,57.38 104.71,58.14 104.71,61.27 ADC2.5
N$28
  Bottom 0.406: SV4.10 91.22,49.96 92.38,51.12 92.38,53.53 93.72,54.88 97.89,54.88 98.91,55.9 109.18,55.9 109.9,56.62 109.9,61.16 ADC2.7
N$29
  Bottom 0.406: SV4.9 91.1,53.74 91.5,54.13 91.77,54.13 93.4,55.76 97.7,55.76 98.58,56.64 106.12,56.64 107.31,57.83 107.31,61.21 ADC2.6
N$30
  Top 0.406: SV4.8 93.86,49.96 94.93,51.08 94.93,57.7 95.71,58.44 113.91,58.44 114.89,59.42 114.89,61.25 ADC2.9
N$31  (via drill 0.6 pad 1.02)
  Top 0.406: PWM1(OC3A).3 28.14,96.03 29.25,94.93 v49.97,94.93 | 60.83,55.64 63.98,52.49 63.98,50.62 65.55,49.06 65.55,44.74 66.55,43.74 66.55,43.71 66.58,43.68 69.44,43.68 SV1.6 | 60.83,55.64 60.43,56.05 | M-1.6 132.82,92.84 130.58,90.6 130.58,90.4 129.63,89.46 121.35,89.46 120.21,90.6 120.21,94.75 119.46,95.5 74.44,95.5 71.98,93.05 71.04,92.11 58.45,92.11 v55.62,94.93 55.62,72.92 57.1,71.44 60.71,71.44 61.74,70.41 61.74,68.28 59.48,66.03 57.81,64.35 57.81,58.66 60.83,55.64
  Bottom 0.406: v55.62,94.93 v49.97,94.93
  Bottom 1.016: M-1.6 M-1.5
N$32  (via drill 0.6 pad 1.02)
  Top 0.406: PWM11(OC5B).3 54.36,46.34 54.7,46.68 60.52,46.68 61.71,45.5 61.71,41.95 62.52,41.14 79.67,41.14 82.75,38.06 86.54,38.06 v86.61,38.13 | v86.58,23.24 86.58,16.95 84.82,15.19 84.82,13.06 SV2.13 | M11.6 161.02,18.41 161.6,17.82 161.6,9.68 v161.56,9.64
  Bottom 0.406: v86.61,38.13 86.61,23.28 v86.58,23.24 | v161.56,9.64 140.24,9.64 139.45,8.85 139.45,5.3 136.69,2.54 90.55,2.54 88.45,4.64 88.45,9.43 SV2.13
  Bottom 1.016: M11.6 M11.5
N$33
  Bottom 0.406: PORT-C.3 130.56,14.87 129.22,16.21 122.65,16.21 121.35,17.51 121.35,24.58 118.62,27.3 112.8,27.3 110.26,24.76 110.26,23.83 109.83,23.4 | 109.83,23.4 | 109.83,23.4 109.64,23.34 102.52,23.34 101.65,22.35 101.58,22.35 SV3.6
N$34
  Bottom 0.406: PORT-C.4 121.58,14.87 120.61,15.84 120.61,24.14 118.38,26.37 113.24,26.37 111.25,24.39 111.25,23.46 109.77,21.97 103.85,21.97 SV3.5
N$35
  Bottom 0.406: PORT-C.5 130.67,17.55 129.53,18.69 123.64,18.69 122.96,19.37 123.02,19.43 123.02,25.58 122.89,25.71 122.89,25.73 119.52,29.1 112.06,29.1 108.71,25.82 102.45,25.82 SV3.8
N$36
  Bottom 0.406: PORT-C.6 123.07,17.41 122.22,18.26 122.22,24.95 118.87,28.29 112.56,28.29 108.9,24.64 103.88,24.64 SV3.7
N$37
  Top 0.406: PORT-C.7 130.67,20.15 129.65,21.17 125.13,21.17 124.63,21.66 124.63,24.02 123.64,25.01 | 123.64,25.01 123.27,25.38 | SV3.10 101.26,26.71 102.15,25.82 122.84,25.82 123.64,25.01
N$38
  Bottom 0.406: PORT-C.8 124.18,19.95 123.76,20.36 123.76,26.1 120.03,29.83 111.55,29.83 108.71,26.99 103.91,26.99 SV3.9
N$39
  Bottom 0.406: PORT-J.1 130.82,37.46 129.53,36.16 124.07,36.16 123.39,35.48 123.39,33.31 121.61,31.5 | 121.61,31.5 120.98,30.85 | SV3.14 101.46,32.18 102.6,31.04 102.6,31.03 102.66,30.97 108.32,30.97 108.62,30.67 120.78,30.67 121.61,31.5
N$40
  Bottom 0.406: PORT-J.2 123.17,37.55 122.65,37.03 122.65,33.62 120.73,31.7 108.9,31.7 108.16,32.45 104.06,32.45 SV3.13
N$41
  Bottom 0.406: PORT-J.3 130.82,40.06 129.65,38.89 122.71,38.89 121.97,38.15 121.97,33.99 120.42,32.54 109.77,32.54 108.61,33.56 102.37,33.56 SV3.16
N$42
  Bottom 0.406: PORT-J.4 122.12,40.09 121.29,39.26 121.29,39.25 121.18,39.15 121.18,34.98 119.69,33.49 110.67,33.49 110.59,33.41 108.96,34.86 103.94,34.86 SV3.15
N$43
  Bottom 0.406: PORT-J.5 130.82,42.6 129.65,41.43 120.98,41.43 120.42,40.88 120.42,35.64 119.03,34.24 111.24,34.24 111.15,34.33 111.06,34.33 109.36,36.04 102.48,36.04 SV3.18
N$44
  Bottom 0.406: PORT-J.6 120.32,42.63 119.91,42.22 | 119.91,42.22 119.8,42.11 | SV3.17 103.94,37.4 109.29,37.4 111.65,35.05 118.13,35.05 119.7,36.61 119.7,42.01 119.91,42.22
N$45
  Bottom 0.406: PORT-J.7 130.82,44.9 129.83,43.91 119.49,43.91 119.42,43.83 | 119.42,43.83 119.06,43.48 | SV3.20 102.48,38.58 109.5,38.58 112,36.08 117.91,36.08 118.8,36.97 118.8,43.22 119.42,43.83
N$46
  Bottom 0.406: SV4.3 98.72,52.56 100.23,54.07 118.5,54.07 118.87,53.7 118.87,46.08 119.61,45.33 128.12,45.33 PORT-J.8
N$47
  Bottom 0.406: SV4.7 93.64,53.36 94.23,53.95 98.55,53.95 99.52,54.92 110.66,54.92 112.23,56.48 112.23,61.34 ADC2.8
N$48
  Bottom 0.406: PORT-A.1 114.31,49.71 112.68,51.34 100.1,51.34 SV4.4
N$49
  Bottom 0.406: SV4.1 115.73,52.5 116.95,51.28 116.95,47.81 PORT-A.2
N$50
  Bottom 0.406: SV4.2 110.16,49.96 112.12,48 112.12,46.08 113.05,45.15 114.29,45.15 PORT-A.3
N$51
  Bottom 0.406: PORT-A.4 115.59,43.91 112.18,43.91 110.76,45.33 110.76,46.95 108.71,48.99 102.83,48.99 SV3.26
N$52
  Bottom 0.406: SV3.23 109.04,44.88 111.25,42.67 114.28,42.67 PORT-A.5
N$53
  Bottom 0.406: SV3.24 101.3,44.88 102.52,43.66 108.65,43.66 110.82,41.49 | 110.82,41.49 | 110.82,41.49 111.07,41.37 115.59,41.37 PORT-A.6
N$54
  Bottom 0.406: SV3.21 108.61,42.34 110.88,40.07 114.29,40.07 PORT-A.7
N$55
  Bottom 0.406: SV3.22 101.3,42.34 102.52,41.12 108.53,41.12 109.77,39.88 109.77,39.82 110.82,38.77 115.52,38.77 PORT-A.8
N$56
  Bottom 0.406: SV2.26 101.26,14.39 102.79,12.85 108.07,12.85 108.65,13.43 108.65,16.83 112,20.19 114.55,20.19 PORT-D.8
N$57
  Bottom 0.406: PORT-D.7 115.93,18.98 112.05,18.98 109.54,16.52 109.56,16.5 109.56,11.03 108.59,10.06 99.79,10.06 98.72,11.13 SV2.23
N$58
  Bottom 0.406: PORT-D.6 111.97,17.69 110.42,16.15 110.42,10.36 109.3,9.24 109.3,9.2 109.15,9.05 98.67,9.05 97.41,10.31 97.41,13.26 98.56,14.4 SV2.24
N$59
  Bottom 0.406: 111.19,15.64 111.14,15.68 | PORT-D.5 117.13,17.59 115.95,16.4 111.95,16.4 111.19,15.64 | SV2.21 96.18,9.53 97.63,8.08 109.45,8.08 111.19,9.82 111.19,15.64
N$60
  Bottom 0.406: PORT-D.2 114.59,6.25 113.69,5.35 93.29,5.35 92.36,6.28 92.36,13.17 93.59,14.4 SV2.20
N$61
  Bottom 0.406: PORT-D.3 115.9,13.94 113.48,13.94 112.67,13.13 112.67,6.49 112.25,6.07 94.1,6.07 93.38,6.79 93.38,11.6 SV2.19
N$62
  Bottom 0.406: SV2.22 96.05,14.4 94.91,13.26 94.91,8.72 96.66,6.96 109.3,6.96 109.36,6.9 109.95,6.9 111.91,8.86 111.91,14.15 113.01,15.25 114.49,15.25 PORT-D.4
N$63
  Bottom 0.406: SV2.17 91.12,11.84 91.12,5.52 92.19,4.45 115.51,4.45 116.12,5.06 116.12,11.24 117.13,12.25 PORT-D.1
N$64
  Bottom 1.27: D3.A 16.71,88.59 R1.1
N$65
  Bottom 1.422: 1.85,73.22 1.85,71.23 1.85,51.59 2.58,50.86 5.21,50.86 S1.2
  Bottom 1.676: J1.2 2.11,94.27 1.72,93.88 1.72,73.35 1.85,73.22 | J7.3 17.2,67.12 13.62,70.69 2.39,70.69 1.85,71.23
  Bottom 1.778: 1.85,73.22 1.85,73.77
N$66  (via drill 0.6 pad 1.02)
  Top 0.406: v86.95,66.48 86.95,66.26 88.29,64.93 88.98,64.93 89.85,64.05 89.85,59.14 89.16,58.45 81.08,58.45 79.65,57.02 v79.65,44.83
  Bottom 0.406: DIS1.11 86.9,66.54 v86.95,66.48 | v79.65,44.83 70.83,44.83 SV1.4
N$67  (via drill 0.6 pad 1.02)
  Top 0.406: v89.18,68.72 89.18,66.97 90.85,65.3 90.85,57.96 90.29,57.4 83.69,57.4 82.26,55.98 82.26,44.4 82.22,44.36 82.22,44.06 v81.74,43.58
  Bottom 0.406: DIS1.12 89.44,68.97 v89.18,68.72 | v81.74,43.58 69.54,43.58 SV1.3
N$68  (via drill 0.6 pad 1.02)
  Top 0.406: v91.87,67.41 91.87,57.11 91,56.24 86.41,56.24 84.82,54.65 84.82,44.32 84.84,44.3 84.84,43.65 v83.25,42.05
  Bottom 0.406: DIS1.13 91.98,67.52 v91.87,67.41 | v83.25,42.05 74,42.05 73.11,41.16 69.6,41.16 SV1.7
N$69  (via drill 0.6 pad 1.02)
  Top 0.406: v94.44,66.44 94.31,66.44 92.72,64.85 92.72,55.98 91.98,55.23 88.4,55.23 87.36,54.19 87.36,44.62 87.25,44.51 87.25,43.41 v84.49,40.65
  Bottom 0.406: DIS1.14 94.52,66.51 v94.44,66.44 | v84.49,40.65 74.17,40.65 SV1.10
N$70
  Bottom 0.406: SV1.2 62.89,55.31 62.89,63.11 64.81,65.03 65.75,65.03 66.15,65.43 66.15,68.51 69.21,71.57 69.21,73.64 | DIS1.4 69.16,98.65 69.16,75.28 69.21,75.22 69.21,73.64 | 69.21,73.64 69.21,73.18
N$71  (via drill 0.6 pad 1.02)
  Top 0.406: v67.52,94.38 67.52,95.26 68.4,96.14 71.65,96.14 DIS1.6
  Bottom 0.406: SV1.1 68.24,47.45 61.68,54.01 61.68,63.84 63.8,65.96 64.51,65.96 65.28,66.74 65.28,69 67.54,71.25 67.54,74.28 | v67.52,94.38 67.52,75.46 67.54,75.44 67.54,74.28 | 67.54,74.28 67.54,73.77
N$72
  Bottom 0.406: SV1.11 67.98,34.98 62.19,34.98 61.76,34.55 61.76,29.97 59.66,27.87 57.16,27.87 56.17,26.88 56.17,23.89 PORT-H&B.1
N$73  (via drill 0.4 pad 1.02, 0.6 pad 1.02)
  Top 0.406: 125.19,94.37 125.22,94.4 | v120.24,51.63 120.24,51.38 118.35,49.49 106.4,49.49 105.66,48.74 100.45,48.74 98.93,47.22 97.3,47.22 95.95,45.87 95.95,37.61 v95.51,37.17 | v72.64,25.45 72.64,17.33 72.1,16.79 72.1,13.18 SV2.1 | 125.19,94.37 125.31,94.49 | v140.79,100.7 136.99,100.7 135.85,101.84 135.73,101.72 127.49,101.72 126.41,100.64 126.41,95.45 125.33,94.37 125.19,94.37 | v125.15,94.33 125.19,94.37
  Bottom 0.406: M2.8 154.17,95.08 152.96,96.29 152.96,98.75 151,100.7 v140.79,100.7 | v125.15,94.33 125.15,54.41 123.7,52.95 121.56,52.95 v120.24,51.63 | v95.51,37.17 93.21,37.17 90.36,34.32 90.36,24.94 91.93,23.37 93.32,23.37 93.95,22.74 93.95,20.22 93.51,19.78 83.86,19.78 83.1,20.53 83.1,22.36 81.09,24.38 76.17,24.38 74.91,25.64 72.83,25.64 v72.64,25.45
  Bottom 1.016: M2.8 M2.7
N$74
  Bottom 0.406: PORT-H&B.2 58.62,26.44 59.19,27.02 60.38,27.02 62.38,29.02 | 62.38,29.02 | 62.38,29.02 62.62,29.26 62.62,33.12 63.13,33.45 69.66,33.45 70.78,32.34 SV1.14
N$75
  Bottom 0.406: PORT-H&B.3 56.08,21.33 57.28,22.53 59.9,22.53 60.81,23.44 60.81,25.92 63.33,28.45 63.38,28.45 63.48,28.54 63.48,31.54 64.05,32.12 68.17,32.12 SV1.13
N$76
  Bottom 0.406: PORT-H&B.4 60.54,21.26 62,22.73 62,25.16 62.43,25.59 62.43,25.63 62.67,25.87 69.47,25.87 SV1.20
N$77  (via drill 0.6 pad 1.02)
  Top 0.406: v120.74,49.8 120.62,49.8 118.79,47.97 118.79,46.97 118.3,46.49 105.99,46.49 105.76,46.26 105.75,46.26 105.67,46.18 97.81,46.18 96.94,45.32 96.94,35.51 v96.86,35.43 | v74.23,23.91 74.23,15.31 SV2.4 | v123.9,101.87 123.9,97.7 v123.95,97.66
  Bottom 0.406: M3.8 167.92,95.18 166.24,96.86 166.24,99.59 163.97,101.86 v123.91,101.86 v123.9,101.87 | v120.74,49.8 122.57,51.63 123.83,51.63 126.89,54.69 126.89,95.09 124.32,97.66 v123.95,97.66 | v96.86,35.43 93.4,35.43 91.56,33.59 91.56,25.49 92.52,24.52 94.14,24.52 94.89,23.78 94.89,19.36 94.32,18.79 82.59,18.79 82.02,19.36 82.02,21.85 80.66,23.21 74.93,23.21 v74.23,23.91
  Bottom 1.016: M3.8 M3.7
N$78
  Bottom 0.406: PORT-H&B.5 56.08,18.85 57.23,20.01 61.38,20.01 63.19,21.82 63.19,23.97 63.81,24.58 68.22,24.58 SV1.19
N$79  (via drill 0.6 pad 1.02)
  Top 0.406: M-1.8 131.78,95.38 129.26,92.86 129.26,91.73 128.88,91.35 124.17,91.35 v123.79,90.97 | v94.06,38.57 94.6,39.11 94.6,40.98 94.24,41.34 90.01,41.34 88.44,42.91 88.44,46.26 88.3,46.39 88.3,48.18 88.49,48.37 90.47,48.37 90.79,48.05 96.77,48.05 97.5,48.83 97.5,53.98 98.29,54.72 119.91,54.72 v120.62,54
  Bottom 0.406: v123.79,90.97 123.79,55.47 122.78,54.45 121.08,54.45 v120.62,54 | v94.06,38.57 92.74,38.57 89.17,34.99 89.17,24.48 91.01,22.63 91.01,22.06 90.07,21.12 85.17,21.12 84.61,21.69 84.61,22.39 81.24,25.76 76.51,25.76 75.51,26.76 73.43,26.76 72.68,27.51 72.65,27.51 72.02,28.15 72,28.15 71.79,28.36 69.49,28.36 SV1.17
  Bottom 1.016: M-1.8 M-1.7
N$80  (via drill 0.4 pad 1.02, 0.6 pad 1.02)
  Top 0.406: v142.25,75.72 131.66,75.72 v131.35,75.42 | v123.74,47.13 123.74,42.61 122.51,41.39 106.21,41.39 105.89,41.07 99.69,41.07 99.16,40.55 99.16,30.1 97.56,28.5 97.56,24.75 v97.44,24.62
  Bottom 0.406: M5.8 155.39,71.19 150.76,75.81 142.34,75.81 v142.25,75.72 | 131.25,54.46 127.45,50.66 127.27,50.66 v123.74,47.13 | 131.25,54.46 131.35,54.56 | v97.44,24.62 97.44,17.91 96.03,16.51 80.41,16.51 79.76,15.86 79.76,13.04 SV2.9 | v131.35,75.42 131.59,75.42 133.79,73.22 135,73.22 135.58,72.64 135.58,58.79 131.25,54.46
  Bottom 1.016: M5.8 M5.7
N$81  (via drill 0.6 pad 1.02)
  Top 0.406: M4.8 129.3,71.08 v129.24,71.14 | v120.64,47.12 120.64,45.34 119.31,44.01 119.28,44.01 119.15,43.88 105.34,43.88 105.07,43.55 99.21,43.55 98.23,42.63 98.23,33.65 97.8,33.22 v96.64,33.22
  Bottom 0.406: v120.64,47.12 122.98,49.45 123.6,49.45 128.02,53.87 128.02,70.09 129.07,71.14 v129.24,71.14 | v96.64,33.22 93.86,33.22 92.36,31.72 92.36,26.35 93.34,25.36 94.69,25.36 95.67,24.37 95.67,18.37 95.05,17.74 81.79,17.74 81.25,18.28 81.25,21.24 80.18,22.31 73.53,22.31 72.09,21.06 72.09,12.9 SV2.3
  Bottom 1.016: M4.8 M4.7
N$82  (via drill 0.6 pad 0.81)
  Top 0.406: PORT-H&B.6 57.48,19.99 53.21,19.99 v52.37,20.82
  Bottom 0.406: PORT-H&B.6 61.95,18.72 64.14,20.91 64.14,22.73 64.62,23.33 | 64.62,23.33 64.72,23.3 | SV1.22 70.78,22.14 69.62,23.33 64.62,23.33 | 52.35,21.34 v52.37,20.82 | 52.35,21.34 52.35,21.43 | R3.2 47.47,26.22 52.35,21.34
N$83
  Bottom 0.406: PORT-H&B.7 57.23,17.34 57.23,17.39 57.28,17.43 62.57,17.43 65,19.87 65,21.72 65.33,22.06 68.2,22.06 SV1.21
N$84  (via drill 0.4 pad 1.02, 0.6 pad 1.02)
  Top 0.406: M7.8 136.14,45.97 v135.48,46.12 | v119.76,6.42 84.6,6.42 83.2,7.82 83.2,11.59 SV2.11
  Bottom 0.406: v135.48,46.12 135.48,9.32 132.98,6.31 119.87,6.31 v119.76,6.42
  Bottom 1.016: M7.8 M7.7
N$85  (via drill 0.4 pad 1.02, 0.6 pad 1.02)
  Top 0.406: v140.83,77.22 134.25,77.22 134.13,77.09 133.87,77.09 v133.74,76.96 | v122,5.11 83.82,5.11 82.21,6.89 82.21,13.01 SV2.12
  Bottom 0.406: M6.8 168.16,71.44 164.45,75.15 164.45,76.7 164.06,77.09 140.96,77.09 v140.83,77.22 | v122,5.11 122.26,4.85 134.26,4.85 136.84,7.43 136.84,73.86 v133.74,76.96
  Bottom 1.016: M6.8 M6.7
N$86
  Bottom 0.406: PORT-H&B.8 63.04,16.18 66.19,19.34 66.19,20.25 66.72,20.77 69.53,20.77 70.78,19.52 SV1.24
N$87  (via drill 0.6 pad 0.81)
  Top 0.406: v50.41,10.83 50.41,8.97 52.08,7.29 56.77,7.29 D4.A
  Bottom 0.406: R2.1 50.45,10.88 v50.41,10.83
N$88
  Top 0.406: SV2.18 92.31,13.19 92.31,10.56 93.43,9.43 130.99,9.43 132.07,10.5 138.68,10.5 139.85,11.68 139.85,18.98 M9.8
  Bottom 1.016: M9.8 M9.7
N$89  (via drill 0.4 pad 1.02, 0.6 pad 1.02)
  Top 0.406: v140.83,51.61 134.92,51.61 v134.04,51.46 | v118.36,7.82 90.09,7.82 88.36,9.54 88.36,11.67 SV2.15
  Bottom 0.406: M8.8 155.01,46.14 153.52,47.63 153.52,50.32 152.44,51.4 141.05,51.4 v140.83,51.61 | v134.04,51.46 134.04,9.82 132.55,7.82 v118.36,7.82
  Bottom 1.016: M8.8 M8.7
N$90  (via drill 0.4 pad 1.02)
  Top 0.406: SV3.1 102.51,18.23 99.61,18.23 99,18.84 99,27.51 99.93,28.44 100,28.37 105.3,28.37 105.46,28.21 v141.61,28.21
  Bottom 0.406: M11.8 155.77,20.95 151.3,25.42 144.41,25.42 v141.61,28.21
  Bottom 1.016: M11.8 M11.7
N$91
  Bottom 0.406: 73.1,8.11 73.09,8.13 | SV2.6 75.8,14.4 74.58,13.19 74.58,9.6 73.1,8.11 | D4.K 61.59,5.8 63.58,7.79 72.78,7.79 73.1,8.11
N$92  (via drill 0.4 pad 1.02, 0.6 pad 1.02)
  Top 0.406: v132.77,53.53 v140.72,53.66 | v119.44,11.26 106.94,11.26 SV3.2
  Bottom 0.406: M10.8 168.46,46.13 165.88,48.71 165.88,51.72 163.95,53.66 v140.72,53.66 | v119.44,11.26 120.19,10.51 120.22,10.53 131.54,10.53 132.77,11.76 v132.77,53.53
  Bottom 1.016: M10.8 M10.7
N$95
  Bottom 1.778: 21.73,8.88 21.73,39.78 21.91,39.96 21.91,40.14 21.55,40.51 21.55,40.14 20.45,39.04 20.64,39.04 21,38.68 21,40.32 | 21,40.32 | 21,40.32 21.18,40.51 | 21.18,40.51 | 21.18,40.51 21.91,40.51 | 21,40.32 21.18,40.51 | 21,40.32 20.64,39.96 20.64,38.5 21.18,37.95 22.83,37.95 22.83,38.13 23.19,38.5 23.19,39.23 23.37,39.41 23.37,40.14 23.19,40.32 22.1,40.32 21.73,40.69
N$96
  Bottom 1.778: 20.82,8.88 20.82,9.25 20.64,9.43 20.64,10.16 20.82,10.16 21.18,10.53 22.28,10.53 22.83,9.98 22.83,9.79 23.19,9.43 23.19,8.15 22.83,7.78 21.91,7.78 21.73,7.6 21.18,7.6 20.27,8.51
N$97  (via drill 0.4 pad 1.02)
  Top 0.406: SV3.19 103.84,39.76 106.82,39.76 106.82,39.62 113.8,32.63 v159.88,32.63
  Bottom 0.406: M12.8 166.68,21.2 165.87,22.01 165.87,25.81 165.89,25.83 165.89,30.27 165.35,30.82 | 165.35,30.82 165.01,31.16 | v159.88,32.63 163.54,32.63 165.35,30.82
  Bottom 1.016: M12.8 M12.7
N$98
  Bottom 1: 101.28,103.01 103.43,103.01 103.48,102.96 101.4,102.96 101.17,103.19
N$99
  Top 0.406: 46.12,56.05 46.17,56.05 47.64,57.52
N$101
  Top 0.406: 47.36,63.78 48.12,63.78 48.21,63.87 48.21,63.82 48.56,63.47 48.56,63.33 48.74,63.15 48.74,62.57 48.79,62.53 48.79,62.88 48.34,63.33
N$102
  Bottom 1.016: 138.67,91.22 138.67,89.33 138.39,89.05 138.39,91.38 138.8,91.78
N$103
  Bottom 1.016: 174.05,87.7 174.05,87.94 | 174.05,87.7 174.05,86.29 | 174.05,87.7 174.25,87.9
N$104  (via drill 0.6 pad 0.81)
  Top 0.406: v47.44,11.06 47.44,6.76 D5.A
  Bottom 0.406: R3.1 47.47,11.1 v47.44,11.06
(copper drawn outside any net)
  shapes: Top area x4